# EAGLE schematic avr_101 (EAGLE 6.4)
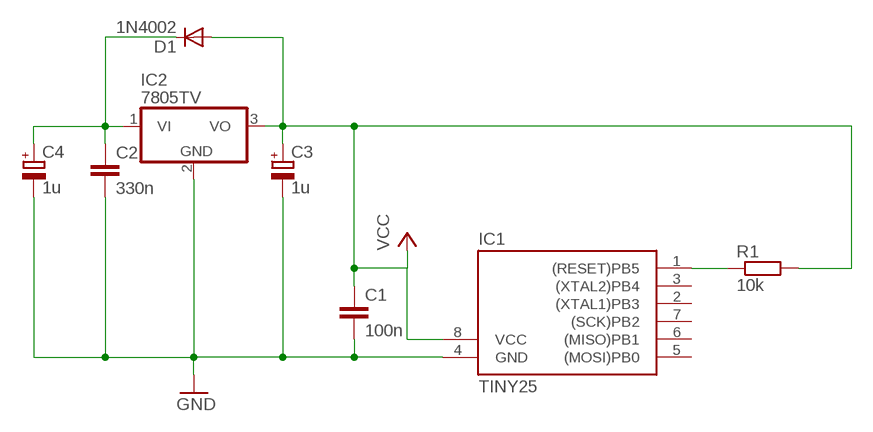
[diagram p0: schematic, sheet 1]

## Parts
C1  100n  C-EUC0805  [C0805]
C2  330n  C-EUC0805  [C0805]
C3  1u  CPOL-EU150CLZ-0810  [150CLZ-0810]
C4  1u  CPOL-EU150CLZ-0810  [150CLZ-0810]
D1  1N4002  1N4004  [DO41-10]
IC1  TINY25  TINY12P  [DIL08]
IC2  7805TV  [TO220V]
R1  10k  R-EU_R0805  [R0805]

## Nets
GND: C1.2 C2.2 C3.- C4.- IC1.4(GND) IC2.2(GND)
N$3: IC1.1((RESET)PB5) R1.1
N$11: C2.1 C4.+ D1.C IC2.1(VI)
VCC: C1.1 C3.+ D1.A IC1.8(VCC) IC2.3(VO) R1.2
Unconnected: IC1.2((XTAL1)PB3) IC1.3((XTAL2)PB4) IC1.5((MOSI)PB0) IC1.6((MISO)PB1) IC1.7((SCK)PB2)

## Library data of the parts
C1 C2 = resistor:C-EU: CAPACITOR, European symbol
C3 C4 = resistor:CPOL-EU: POLARIZED CAPACITOR, European symbol
D1 = diode:1N4004: DIODE general purpose rectifier, 1 A
IC1 = atmel:TINY12*: MICROCONTROLLER 1 Kbytes FLASH 64 bytes EEPROM; OC_FARNELL: unknown; OC_NEWARK: unknown
IC2 = linear:78*: Positive VOLTAGE REGULATOR Source: http://cache.national.com/ds/LM/LM78L05.pdf http://www.fairchildsemi.com/ds/LM/LM7805.pdf
R1 = resistor:R-EU_: RESISTOR, European symbol